# Altium schematic sheet Analog to Digital Converter.SchDoc
size A
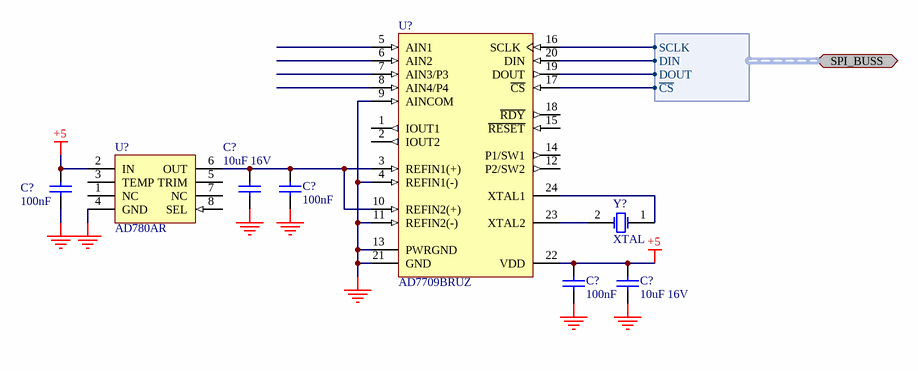
[diagram p0: Analog to Digital Converter.SchDoc]

## Parts
(Parts that share a designator on the sheet are numbered #1, #2 ... from top to bottom, then left to right.)
C?#1  value 100nF  [CAPC0805(2012)145_N]  (hidden comment: CAP 100nF 50V 0805(2012))
C?#2  value 10uF 16V  [CAPC0805(2012)145_M]  (hidden comment: CAP 10uF 16V 0805(2012))
C?#3  value 100nF  [CAPC0805(2012)145_N]  (hidden comment: CAP 100nF 50V 0805(2012))
C?#4  value 100nF  [CAPC0805(2012)145_N]  (hidden comment: CAP 100nF 50V 0805(2012))
C?#5  value 10uF 16V  [CAPC0805(2012)145_M]  (hidden comment: CAP 10uF 16V 0805(2012))
U?#1  AD7709BRUZ  [RU-24_L]
U?#2  AD780AR  [R-8C_L]
Y?  XTAL  [CMR200T]

## Ports
SPI_BUSS (harness SPI BUSS)

## Harnesses
SPI BUSS: SCLK, DIN, DOUT, ~{CS}

## Nets
+5: C?#1.2 C?#4.2 C?#5.2 U?#1.22(VDD) U?#2.2(IN)
GND: C?#1.1 C?#2.1 C?#3.1 C?#4.1 C?#5.1 U?#1.4(REFIN1(-)) U?#1.9(AINCOM) U?#1.11(REFIN2(-)) U?#1.13(PWRGND) U?#1.21(GND) U?#2.4(GND)
NetC?#2_2: C?#2.2 C?#3.2 U?#1.3(REFIN1(+)) U?#1.10(REFIN2(+)) U?#2.6(OUT)
NetU?#1_16: U?#1.16(SCLK) ; port SPI_BUSS.SCLK
NetU?#1_17: U?#1.17(~{CS}) ; port SPI_BUSS.~{CS}
NetU?#1_19: U?#1.19(DOUT) ; port SPI_BUSS.DOUT
NetU?#1_20: U?#1.20(DIN) ; port SPI_BUSS.DIN
NetU?#1_23: U?#1.23(XTAL2) Y?.2(OSC2)
NetU?#1_24: U?#1.24(XTAL1) Y?.1(OSC1)

Not connected (* = marked no-connect by the designer): U?#1 1(IOUT1) 2(IOUT2) 5(AIN1) 6(AIN2) 7(AIN3/P3) 8(AIN4/P4) 12(P2/SW2) 14(P1/SW1) 15(~{RESET}) 18(~{RDY}); U?#2 1(NC) 3(TEMP) 5(TRIM) 7(NC) 8(SEL)

## Library data of the parts
C?#1 C?#3 C?#4 = CMP-1036-04422-1: CAP 100nF 50V ±20% 0805 (2012 Metric) Thickness 1.45mm SMD; Case-Metric: 2012; Case-EIA: 0805; Tolerance: ±20%; Max Thickness: 1.45 mm; Technology: SMT; Rated Voltage: 50 V
C?#2 C?#5 = CMP-1036-04929-1: CAP 10uF 16V ±20% 0805 (2012 Metric) Thickness 1.45mm SMD; Case-EIA: 0805; Case-Metric: 2012; Tolerance: ±20%; Rated Voltage: 16 V; Technology: SMT; Max Thickness: 1.45 mm
U?#1 = CMP-0313-01986-2: Quad 16-Bit Sigma-Delta Analog-to-Digital Converter with Serial, SPI Interface, 105SPS, -40 to +85 degC, RU-24, Pb-Free, Tube; Manufacturer: Analog Devices; Generic Part Number: AD7709; Interface: Ser, SPI; Resolution (Bits): 16; Throughput Rate (SPS): 105; Channels: 4; ComponentLink4Description: Product URL; Packing: Tube; DatasheetVersion: Rev.A; ComponentLink3Description: Package Specification; PackageReference: RU-24; PackageDescription: 24-Lead Thin Shrink Small Outline Package [TSSOP]; RoHS: Y; Code_JEDEC: MO-153-AD; ComponentLink1Description: Manufacturer URL; PackageVersion: 2002; ComponentLink2URL: http://www.analog.com/static/imported-files/data_sheets/AD7709.pdf; ComponentLink4URL: http://www.analog.com/en/analog-to-digital-converters/ad-converters/ad7709/products/product.html; PartNumber: AD7709BRUZ; ComponentLink2Description: Datasheet; ComponentLink3URL: http://www.analog.com/static/imported-files/packages/380523655245964505593671154107510036154RU24.pdf; Mounting Technology: Surface Mount; ComponentLink1URL: http://www.analog.com/en/index.html
U?#2 = AD780AR: 2.5V/3.0V Ultrahigh Precision Bandgap Voltage Reference; Note: Pins 1 and 7 are not connected; Published: 8-Jun-2000; LatestRevisionDate: 13-Apr-2006; LatestRevisionNote: IPC-7351 Footprint Added.; DatasheetVersion: REV. A; PackageVersion: revC; PackageReference: R-8C; Publisher: Altium Limited; PackageDescription: 8-Pin Small Outline Integrated Circuit 1.27 mm Pitch; Code_IPC: SOIC127P600-8; ComponentLink1Description: Manufacturer Link; ComponentLink1URL: http://www.analog.com/en/prod/0,,769_838_AD780%2C00.html; ComponentLink2Description: Datasheet; ComponentLink2URL: http://www.analog.com/UploadedFiles/Data_Sheets/87683462AD780_e.pdf
Y? = XTAL: Crystal Oscillator; Published: 8-Jun-2000; LatestRevisionDate: 17-Jul-2002; LatestRevisionNote: Re-released for DXP Platform.; PackageReference: R38; Publisher: Altium Limited; PackageDescription: Crystal, Thru-Hole; 2 Leads; Body 3.1 x 8.2 mm (Dia.xH)